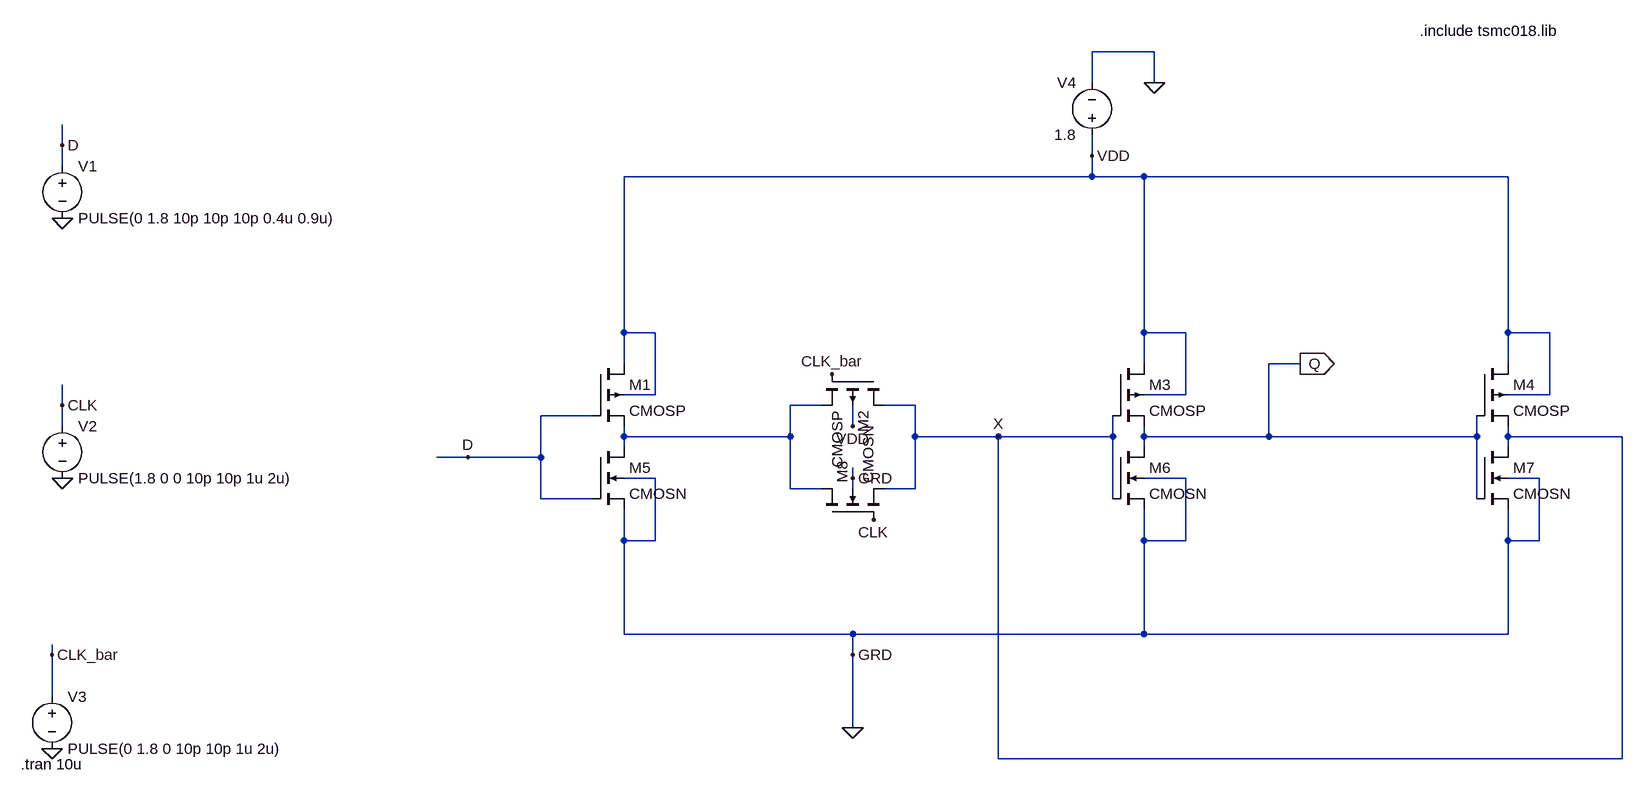
[diagram p0: schematic d_ff_using_tg.asc]
d_ff_using_tg.asc, the LTspice schematic file:
Version 4
SHEET 1 1604 680
WIRE 880 -448 784 -448
WIRE 784 -400 784 -448
WIRE 880 -400 880 -448
WIRE -800 -304 -800 -336
WIRE 784 -288 784 -320
WIRE -800 -272 -800 -304
WIRE 784 -256 784 -288
WIRE 784 -256 64 -256
WIRE 864 -256 784 -256
WIRE 1424 -256 864 -256
WIRE 64 -16 64 -256
WIRE 112 -16 64 -16
WIRE 864 -16 864 -256
WIRE 928 -16 864 -16
WIRE 1424 -16 1424 -256
WIRE 1488 -16 1424 -16
WIRE 64 32 64 -16
WIRE 864 32 864 -16
WIRE 1104 32 1056 32
WIRE 1424 32 1424 -16
WIRE 112 80 112 -16
WIRE 112 80 64 80
WIRE 928 80 928 -16
WIRE 928 80 864 80
WIRE 1488 80 1488 -16
WIRE 1488 80 1424 80
WIRE -800 96 -800 64
WIRE 368 96 320 96
WIRE 512 96 464 96
WIRE 16 112 -64 112
WIRE -800 128 -800 96
WIRE 416 128 416 96
WIRE 64 144 64 128
WIRE 320 144 320 96
WIRE 320 144 64 144
WIRE 512 144 512 96
WIRE 640 144 512 144
WIRE 816 144 816 112
WIRE 816 144 640 144
WIRE 864 144 864 128
WIRE 1056 144 1056 32
WIRE 1056 144 864 144
WIRE 1376 144 1376 112
WIRE 1376 144 1056 144
WIRE 1424 144 1424 128
WIRE 1600 144 1424 144
WIRE 64 160 64 144
WIRE 864 160 864 144
WIRE 1424 160 1424 144
WIRE -176 176 -224 176
WIRE -64 176 -64 112
WIRE -64 176 -176 176
WIRE 112 208 64 208
WIRE 416 208 416 192
WIRE 928 208 864 208
WIRE 1472 208 1424 208
WIRE 320 224 320 144
WIRE 368 224 320 224
WIRE 416 224 416 208
WIRE 512 224 512 144
WIRE 512 224 464 224
WIRE -64 240 -64 176
WIRE 16 240 -64 240
WIRE 816 240 816 144
WIRE 1376 240 1376 144
WIRE 64 304 64 256
WIRE 112 304 112 208
WIRE 112 304 64 304
WIRE 864 304 864 256
WIRE 928 304 928 208
WIRE 928 304 864 304
WIRE 1424 304 1424 256
WIRE 1472 304 1472 208
WIRE 1472 304 1424 304
WIRE 64 448 64 304
WIRE 416 448 64 448
WIRE 864 448 864 304
WIRE 864 448 416 448
WIRE 1424 448 1424 304
WIRE 1424 448 864 448
WIRE -816 480 -816 464
WIRE 416 480 416 448
WIRE -816 544 -816 480
WIRE 416 592 416 480
WIRE 640 640 640 144
WIRE 1600 640 1600 144
WIRE 1600 640 640 640
FLAG 416 592 0
FLAG 880 -400 0
FLAG -800 -192 0
FLAG -800 208 0
FLAG -816 624 0
FLAG 784 -288 VDD
FLAG 416 128 VDD
FLAG 416 480 GRD
FLAG 416 208 GRD
FLAG -800 -304 D
FLAG -176 176 D
FLAG -800 96 CLK
FLAG 384 48 CLK_bar
FLAG -816 480 CLK_bar
FLAG 448 272 CLK
FLAG 640 144 X
FLAG 1104 32 Q
IOPIN 1104 32 Out
SYMBOL cmosp 16 32 R0
SYMATTR InstName M1
SYMATTR Value2 l=180n w=1600n
SYMBOL cmosp 464 48 R90
SYMATTR InstName M2
SYMATTR Value2 l=180n w=1600n
SYMBOL cmosp 816 32 R0
SYMATTR InstName M3
SYMATTR Value2 l=180n w=1600n
SYMBOL cmosp 1376 32 R0
SYMATTR InstName M4
SYMATTR Value2 l=180n w=800n
SYMBOL cmosn 16 160 R0
SYMATTR InstName M5
SYMATTR Value2 l=180n w=800n
SYMBOL cmosn 816 160 R0
SYMATTR InstName M6
SYMATTR Value2 l=180n w=800n
SYMBOL cmosn 1376 160 R0
SYMATTR InstName M7
SYMATTR Value2 l=180n w=400n
SYMBOL cmosn 368 272 R270
SYMATTR InstName M8
SYMATTR Value2 l=180n w=800n
SYMBOL voltage -800 -288 R0
WINDOW 123 0 0 Left 0
WINDOW 39 0 0 Left 0
SYMATTR InstName V1
SYMATTR Value PULSE(0 1.8 10p 10p 10p 0.4u 0.9u)
SYMBOL voltage -800 112 R0
WINDOW 123 0 0 Left 0
WINDOW 39 0 0 Left 0
SYMATTR InstName V2
SYMATTR Value PULSE(1.8 0 0 10p 10p 1u 2u)
SYMBOL voltage -816 528 R0
WINDOW 123 0 0 Left 0
WINDOW 39 0 0 Left 0
SYMATTR InstName V3
SYMATTR Value PULSE(0 1.8 0 10p 10p 1u 2u)
SYMBOL voltage 784 -304 R180
WINDOW 0 24 96 Left 2
WINDOW 3 24 16 Left 2
WINDOW 123 0 0 Left 0
WINDOW 39 0 0 Left 0
SYMATTR InstName V4
SYMATTR Value 1.8
TEXT 1288 -480 Left 2 !.include tsmc018.lib
TEXT -864 648 Left 2 !.tran 10u

The netlist it stands for:
* d_ff_using_tg.asc
M1 VDD D N001 VDD CMOSP l=180n w=1600n
M2 X CLK_bar N001 VDD CMOSP l=180n w=1600n
M3 VDD X Q VDD CMOSP l=180n w=1600n
M4 VDD Q X VDD CMOSP l=180n w=800n
M5 N001 D 0 0 CMOSN l=180n w=800n
M6 Q X 0 0 CMOSN l=180n w=800n
M7 X Q 0 0 CMOSN l=180n w=400n
M8 N001 CLK X 0 CMOSN l=180n w=800n
V1 D 0 PULSE(0 1.8 10p 10p 10p 0.4u 0.9u)
V2 CLK 0 PULSE(1.8 0 0 10p 10p 1u 2u)
V3 CLK_bar 0 PULSE(0 1.8 0 10p 10p 1u 2u)
V4 VDD 0 1.8
.model NMOS NMOS
.model PMOS PMOS
.lib standard.mos
.include tsmc018.lib
.tran 10u
.backanno
.end